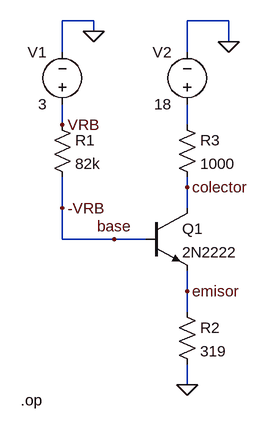
[diagram p0: schematic DiseñoCircuitoTL2Polarizacion.asc]
DiseñoCircuitoTL2Polarizacion.asc, the LTspice schematic file:
Version 4
SHEET 1 880 680
WIRE 96 -112 48 -112
WIRE 304 -112 240 -112
WIRE 96 -96 96 -112
WIRE 304 -80 304 -112
WIRE 48 -64 48 -112
WIRE 240 -64 240 -112
WIRE 48 48 48 16
WIRE 240 48 240 16
WIRE 240 144 240 128
WIRE 48 176 48 128
WIRE 240 176 240 144
WIRE 48 224 48 176
WIRE 128 224 48 224
WIRE 176 224 128 224
WIRE 240 304 240 272
WIRE 240 336 240 304
WIRE 240 448 240 416
FLAG 240 448 0
FLAG 96 -96 0
FLAG 304 -80 0
FLAG 128 224 base
FLAG 240 304 emisor
FLAG 48 48 VRB
FLAG 48 176 -VRB
FLAG 240 144 colector
SYMBOL res 32 32 R0
SYMATTR InstName R1
SYMATTR Value 82k
SYMBOL npn 176 176 R0
SYMATTR InstName Q1
SYMATTR Value 2N2222
SYMBOL res 224 320 R0
SYMATTR InstName R2
SYMATTR Value 319
SYMBOL res 224 32 R0
SYMATTR InstName R3
SYMATTR Value 1000
SYMBOL voltage 48 32 R180
WINDOW 0 24 96 Left 2
WINDOW 3 24 16 Left 2
WINDOW 123 0 0 Left 0
WINDOW 39 0 0 Left 0
SYMATTR InstName V1
SYMATTR Value 3
SYMBOL voltage 240 32 R180
WINDOW 0 24 96 Left 2
WINDOW 3 24 16 Left 2
WINDOW 123 0 0 Left 0
WINDOW 39 0 0 Left 0
SYMATTR InstName V2
SYMATTR Value 18
TEXT -16 472 Left 2 !.op

The netlist it stands for:
* DiseñoCircuitoTL2Polarizacion.asc
R1 VRB -VRB 82k
Q1 colector -VRB emisor 0 2N2222
R2 emisor 0 319
R3 N001 colector 1000
V1 VRB 0 3
V2 N001 0 18
.model NPN NPN
.model PNP PNP
.lib standard.bjt
.op
.backanno
.end